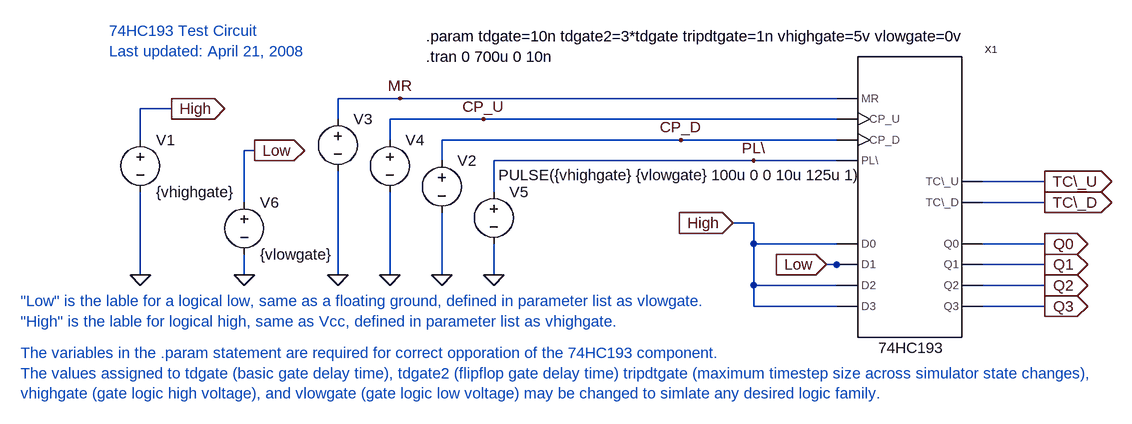
[diagram p0: schematic 74HC193_test.asc]
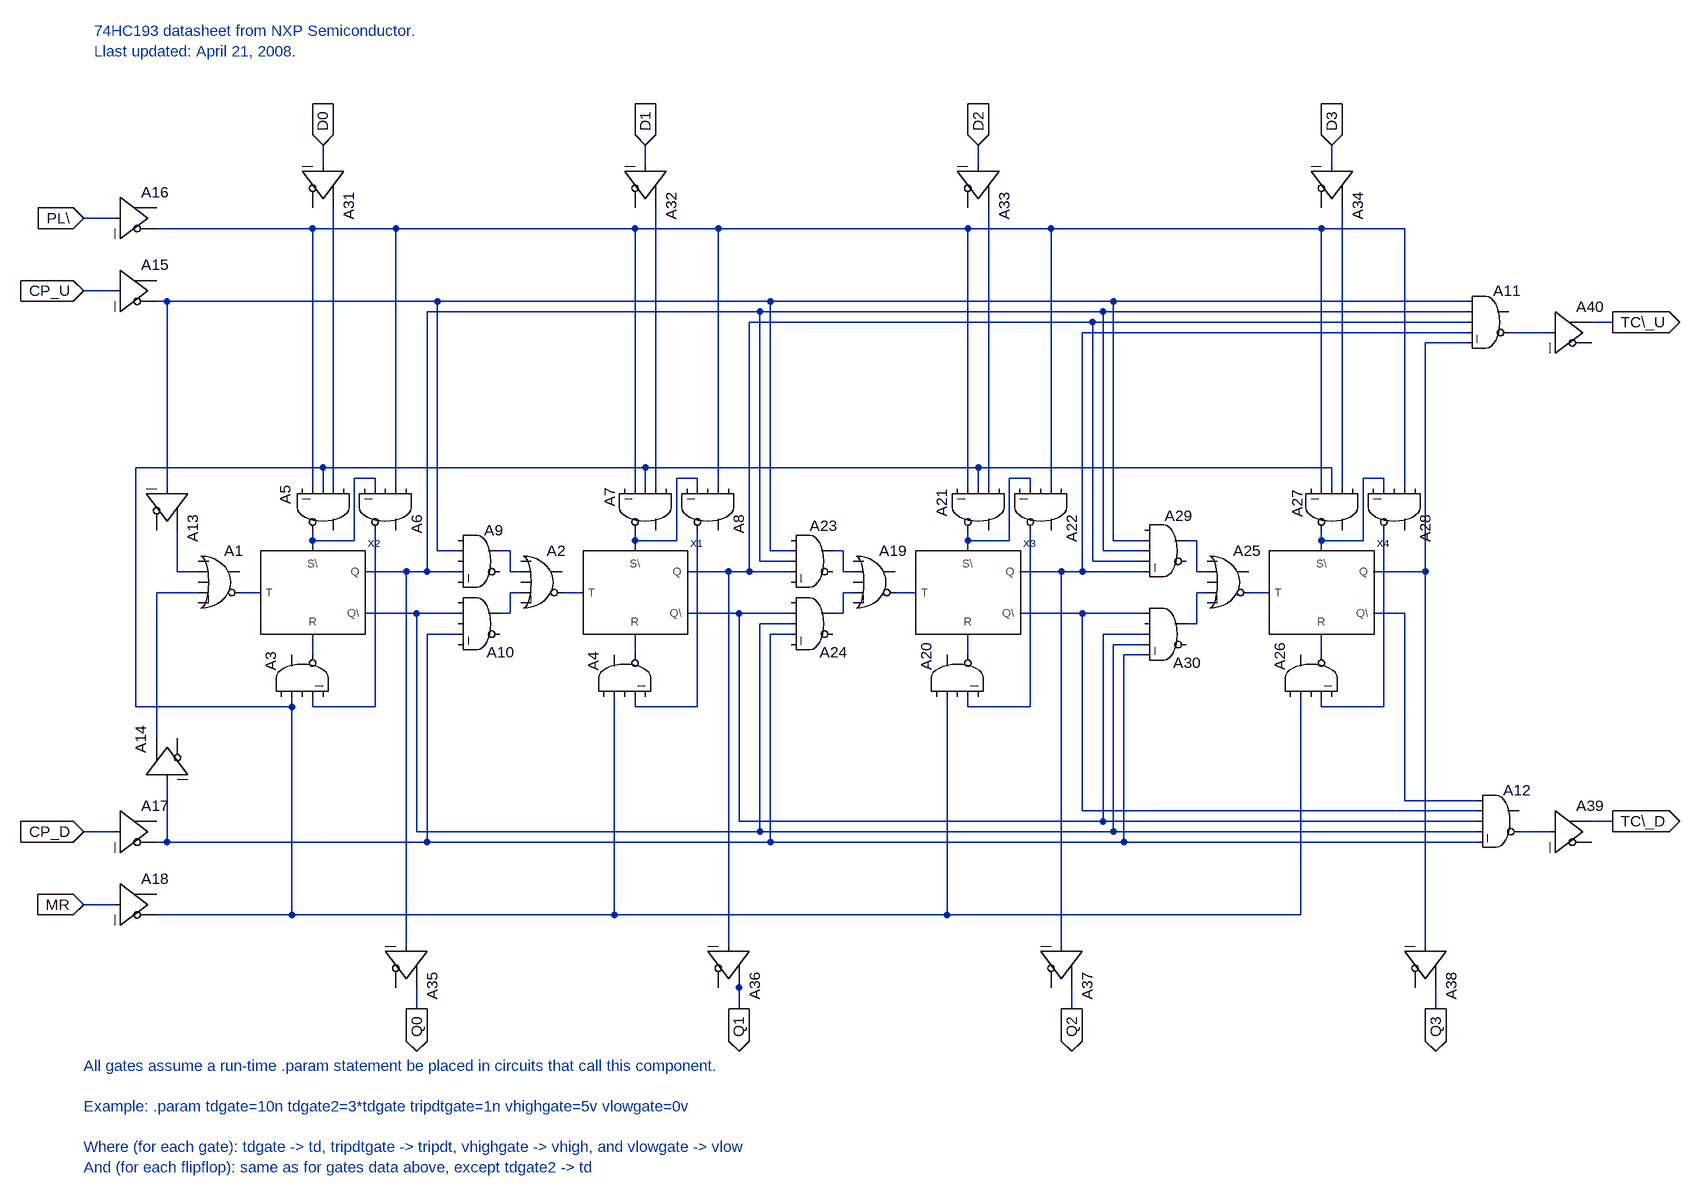
[diagram p1: sub-circuit 74hc193.asc]
74HC193_test.asc, the LTspice schematic file:
Version 4
SHEET 1 1604 868
WIRE -992 -96 -1088 -96
WIRE -320 -96 -992 -96
WIRE -1344 -80 -1392 -80
WIRE -1088 -64 -1088 -96
WIRE -864 -64 -1008 -64
WIRE -320 -64 -864 -64
WIRE -1392 -32 -1392 -80
WIRE -1008 -32 -1008 -64
WIRE -560 -32 -928 -32
WIRE -320 -32 -560 -32
WIRE -1216 -16 -1232 -16
WIRE -928 0 -928 -32
WIRE -448 0 -848 0
WIRE -320 0 -448 0
WIRE 0 32 -96 32
WIRE -848 48 -848 0
WIRE -1232 64 -1232 -16
WIRE 0 64 -96 64
WIRE -448 96 -480 96
WIRE -448 128 -448 96
WIRE -320 128 -448 128
WIRE 0 128 -96 128
WIRE -320 160 -336 160
WIRE -304 160 -320 160
WIRE 0 160 -96 160
WIRE -1392 176 -1392 48
WIRE -1232 176 -1232 144
WIRE -1088 176 -1088 16
WIRE -1008 176 -1008 48
WIRE -928 176 -928 80
WIRE -848 176 -848 128
WIRE -448 192 -448 128
WIRE -320 192 -448 192
WIRE 0 192 -96 192
WIRE -448 224 -448 192
WIRE -320 224 -448 224
WIRE 0 224 -96 224
FLAG -1392 176 0
FLAG -1344 -80 High
IOPIN -1344 -80 Out
FLAG -480 96 High
IOPIN -480 96 In
FLAG -928 176 0
FLAG 0 128 Q0
IOPIN 0 128 Out
FLAG 0 160 Q1
IOPIN 0 160 Out
FLAG 0 192 Q2
IOPIN 0 192 Out
FLAG 0 224 Q3
IOPIN 0 224 Out
FLAG -1088 176 0
FLAG 0 32 TC\_U
IOPIN 0 32 Out
FLAG 0 64 TC\_D
IOPIN 0 64 Out
FLAG -1008 176 0
FLAG -848 176 0
FLAG -992 -96 MR
FLAG -864 -64 CP_U
FLAG -560 -32 CP_D
FLAG -448 0 PL\
FLAG -1232 176 0
FLAG -1216 -16 Low
IOPIN -1216 -16 Out
FLAG -336 160 Low
IOPIN -336 160 In
SYMBOL 74HC193 -208 -192 R0
SYMATTR InstName X1
SYMBOL voltage -1392 -48 R0
WINDOW 123 0 0 Left 0
WINDOW 39 0 0 Left 0
SYMATTR InstName V1
SYMATTR Value {vhighgate}
SYMBOL voltage -1088 -80 R0
WINDOW 123 0 0 Left 0
WINDOW 39 0 0 Left 0
WINDOW 3 7 -13 Invisible 0
SYMATTR Value PWL(0 {vlowgate} 27u {vlowgate} 28u {vhighgate} 37u {vhighgate} 38u {vlowgate} 637u {vlowgate} 638u {vhighgate} 647u {vhighgate} 648u {vlowgate})
SYMATTR InstName V3
SYMBOL voltage -1008 -48 R0
WINDOW 123 0 0 Left 0
WINDOW 39 0 0 Left 0
WINDOW 3 24 104 Invisible 0
SYMATTR Value PWL(0 {vhighgate} 164u {vhighgate} 165u {vlowgate} 184u {vlowgate} 185u {vhighgate} 204u {vhighgate} 205u {vlowgate} 224u {vlowgate} 225u {vhighgate} 244u {vhighgate} 245u {vlowgate} 264u {vlowgate} 265u {vhighgate} 284u {vhighgate} 285u {vlowgate} 304u {vlowgate} 305u {vhighgate} 324u {vhighgate} 325u {vlowgate} 344u {vlowgate} 345u {vhighgate})
SYMATTR InstName V4
SYMBOL voltage -848 32 R0
WINDOW 3 7 -10 Left 0
WINDOW 123 0 0 Left 0
WINDOW 39 0 0 Left 0
SYMATTR Value PULSE({vhighgate} {vlowgate} 100u 0 0 10u 125u 1)
SYMATTR InstName V5
SYMBOL voltage -928 -16 R0
WINDOW 123 0 0 Left 0
WINDOW 39 0 0 Left 0
WINDOW 3 24 104 Invisible 0
SYMATTR Value PWL(0 {vhighgate} 434u {vhighgate} 435u {vlowgate} 454u {vlowgate} 455u {vhighgate} 474u {vhighgate} 475u {vlowgate} 494u {vlowgate} 495u {vhighgate} 514u {vhighgate} 515u {vlowgate} 534u {vlowgate} 535u {vhighgate} 554u {vhighgate} 555u {vlowgate} 574u {vlowgate} 575u {vhighgate} 594u {vhighgate} 595u {vlowgate} 614u {vlowgate} 615u {vhighgate})
SYMATTR InstName V2
SYMBOL voltage -1232 48 R0
WINDOW 123 0 0 Left 0
WINDOW 39 0 0 Left 0
SYMATTR InstName V6
SYMATTR Value {vlowgate}
TEXT -952 -160 Left 0 !.tran 0 700u 0 10n
TEXT -1576 216 Left 0 ;"Low" is the lable for a logical low, same as a floating ground, defined in parameter list as vlowgate.\n"High" is the lable for logical high, same as Vcc, defined in parameter list as vhighgate.
TEXT -952 -192 Left 0 !.param tdgate=10n tdgate2=3*tdgate tripdtgate=1n vhighgate=5v vlowgate=0v
TEXT -1576 296 Left 0 ;The variables in the .param statement are required for correct opporation of the 74HC193 component.\nThe values assigned to tdgate (basic gate delay time), tdgate2 (flipflop gate delay time) tripdtgate (maximum timestep size across simulator state changes),\nvhighgate (gate logic high voltage), and vlowgate (gate logic low voltage) may be changed to simlate any desired logic family.
TEXT -1440 -200 Left 0 ;74HC193 Test Circuit\nLast updated: April 21, 2008

74hc193.asc, the sub-circuit schematic file:
Version 4
SHEET 1 1604 1044
WIRE -528 -544 -528 -576
WIRE -32 -544 -32 -576
WIRE 480 -544 480 -576
WIRE 1024 -544 1024 -576
WIRE -848 -464 -896 -464
WIRE -544 -448 -784 -448
WIRE -416 -448 -544 -448
WIRE -48 -448 -416 -448
WIRE 80 -448 -48 -448
WIRE 464 -448 80 -448
WIRE 592 -448 464 -448
WIRE 1008 -448 592 -448
WIRE 1136 -448 1008 -448
WIRE -848 -352 -896 -352
WIRE -768 -336 -784 -336
WIRE -352 -336 -768 -336
WIRE 160 -336 -352 -336
WIRE 688 -336 160 -336
WIRE 1232 -336 688 -336
WIRE 144 -320 -368 -320
WIRE 672 -320 144 -320
WIRE 1232 -320 672 -320
WIRE 656 -304 128 -304
WIRE 1232 -304 656 -304
WIRE 1456 -304 1424 -304
WIRE 1232 -288 640 -288
WIRE 1360 -288 1296 -288
WIRE 1232 -272 1168 -272
WIRE -528 -80 -816 -80
WIRE -32 -80 -528 -80
WIRE 480 -80 -32 -80
WIRE 1024 -80 480 -80
WIRE -448 -64 -480 -64
WIRE 48 -64 16 -64
WIRE 560 -64 528 -64
WIRE 1104 -64 1072 -64
WIRE -768 -48 -768 -336
WIRE -544 -48 -544 -448
WIRE -528 -48 -528 -80
WIRE -512 -48 -512 -480
WIRE -448 -48 -448 -64
WIRE -416 -48 -416 -448
WIRE -48 -48 -48 -448
WIRE -32 -48 -32 -80
WIRE -16 -48 -16 -480
WIRE 48 -48 48 -64
WIRE 80 -48 80 -448
WIRE 464 -48 464 -448
WIRE 480 -48 480 -80
WIRE 496 -48 496 -480
WIRE 560 -48 560 -64
WIRE 592 -48 592 -448
WIRE 1008 -48 1008 -448
WIRE 1024 -48 1024 -80
WIRE 1040 -48 1040 -480
WIRE 1104 -48 1104 -64
WIRE 1136 -48 1136 -448
WIRE -544 32 -544 16
WIRE -480 32 -480 -64
WIRE -480 32 -544 32
WIRE -48 32 -48 16
WIRE 16 32 16 -64
WIRE 16 32 -48 32
WIRE 464 32 464 16
WIRE 528 32 528 -64
WIRE 528 32 464 32
WIRE 688 32 688 -336
WIRE 736 32 688 32
WIRE 816 32 800 32
WIRE 1008 32 1008 16
WIRE 1072 32 1072 -64
WIRE 1072 32 1008 32
WIRE -544 48 -544 32
WIRE -352 48 -352 -336
WIRE -320 48 -352 48
WIRE -240 48 -256 48
WIRE -48 48 -48 32
WIRE 160 48 160 -336
WIRE 192 48 160 48
WIRE 272 48 256 48
WIRE 464 48 464 32
WIRE 672 48 672 -320
WIRE 736 48 672 48
WIRE 1008 48 1008 32
WIRE 144 64 144 -320
WIRE 192 64 144 64
WIRE 656 64 656 -304
WIRE 736 64 656 64
WIRE -752 80 -752 16
WIRE -720 80 -752 80
WIRE -400 80 -464 80
WIRE -368 80 -368 -320
WIRE -368 80 -400 80
WIRE -320 80 -368 80
WIRE -240 80 -240 48
WIRE -224 80 -240 80
WIRE 96 80 32 80
WIRE 128 80 128 -304
WIRE 128 80 96 80
WIRE 192 80 128 80
WIRE 272 80 272 48
WIRE 288 80 272 80
WIRE 608 80 544 80
WIRE 640 80 640 -288
WIRE 640 80 608 80
WIRE 736 80 640 80
WIRE 816 80 816 32
WIRE 832 80 816 80
WIRE 1168 80 1168 -272
WIRE 1168 80 1088 80
WIRE -720 112 -784 112
WIRE -624 112 -656 112
WIRE -224 112 -240 112
WIRE -128 112 -160 112
WIRE 288 112 272 112
WIRE 384 112 352 112
WIRE 832 112 816 112
WIRE 928 112 896 112
WIRE -384 144 -464 144
WIRE -320 144 -384 144
WIRE -240 144 -240 112
WIRE -240 144 -256 144
WIRE 112 144 32 144
WIRE 192 144 112 144
WIRE 272 144 272 112
WIRE 272 144 256 144
WIRE 640 144 544 144
WIRE 736 144 640 144
WIRE 1136 144 1088 144
WIRE 192 160 144 160
WIRE 816 160 816 112
WIRE 816 160 800 160
WIRE -320 176 -368 176
WIRE 192 176 160 176
WIRE 736 176 672 176
WIRE 736 192 688 192
WIRE -544 208 -544 176
WIRE -48 208 -48 176
WIRE 464 208 464 176
WIRE 736 208 704 208
WIRE 1008 208 1008 176
WIRE -816 288 -816 -80
WIRE -576 288 -576 272
WIRE -576 288 -816 288
WIRE -544 288 -544 272
WIRE -448 288 -448 16
WIRE -448 288 -544 288
WIRE -48 288 -48 272
WIRE 48 288 48 16
WIRE 48 288 -48 288
WIRE 464 288 464 272
WIRE 560 288 560 16
WIRE 560 288 464 288
WIRE 1008 288 1008 272
WIRE 1104 288 1104 16
WIRE 1104 288 1008 288
WIRE -784 336 -784 112
WIRE 1136 432 1136 144
WIRE 1248 432 1136 432
WIRE 640 448 640 144
WIRE 1248 448 640 448
WIRE 112 464 112 144
WIRE 672 464 672 176
WIRE 672 464 112 464
WIRE 1248 464 672 464
WIRE 1456 464 1424 464
WIRE -848 480 -896 480
WIRE -384 480 -384 144
WIRE 144 480 144 160
WIRE 144 480 -384 480
WIRE 688 480 688 192
WIRE 688 480 144 480
WIRE 1248 480 688 480
WIRE 1360 480 1312 480
WIRE -768 496 -768 400
WIRE -768 496 -784 496
WIRE -368 496 -368 176
WIRE -368 496 -768 496
WIRE 160 496 160 176
WIRE 160 496 -368 496
WIRE 704 496 704 208
WIRE 704 496 160 496
WIRE 1248 496 704 496
WIRE -848 592 -896 592
WIRE -576 608 -576 288
WIRE -576 608 -784 608
WIRE -80 608 -80 272
WIRE -80 608 -576 608
WIRE 432 608 432 272
WIRE 432 608 -80 608
WIRE 976 608 976 272
WIRE 976 608 432 608
WIRE -400 656 -400 80
WIRE 96 656 96 80
WIRE 608 656 608 80
WIRE 1168 656 1168 80
WIRE 112 720 112 704
WIRE -384 752 -384 720
WIRE 112 752 112 720
WIRE 624 752 624 720
WIRE 1184 752 1184 720
FLAG -896 -464 PL\
IOPIN -896 -464 In
FLAG -896 -352 CP_U
IOPIN -896 -352 In
FLAG -896 480 CP_D
IOPIN -896 480 In
FLAG -896 592 MR
IOPIN -896 592 In
FLAG -528 -576 D0
IOPIN -528 -576 In
FLAG -32 -576 D1
IOPIN -32 -576 In
FLAG 480 -576 D2
IOPIN 480 -576 In
FLAG 1024 -576 D3
IOPIN 1024 -576 In
FLAG 1456 -304 TC\_U
IOPIN 1456 -304 Out
FLAG 1456 464 TC\_D
IOPIN 1456 464 Out
FLAG 1184 752 Q3
IOPIN 1184 752 Out
FLAG 624 752 Q2
IOPIN 624 752 Out
FLAG 112 752 Q1
IOPIN 112 752 Out
FLAG -384 752 Q0
IOPIN -384 752 Out
SYMBOL TnotSRFlipFlopfromD -48 112 R0
SYMATTR InstName X1
SYMBOL TnotSRFlipFlopfromD -544 112 R0
SYMATTR InstName X2
SYMBOL Digital\\or -688 32 R0
SYMATTR InstName A1
SYMATTR Value2 td={tdgate} tripdt={tripdtgate} vhigh={vhighgate} vlow={vlowgate}
SYMBOL Digital\\or -192 32 R0
SYMATTR InstName A2
SYMATTR Value2 td={tdgate} tripdt={tripdtgate} vhigh={vhighgate} vlow={vlowgate}
SYMBOL Digital\\and -464 -16 R90
WINDOW 0 -37 122 Left 0
SYMATTR InstName A5
SYMATTR Value2 td={tdgate} tripdt={tripdtgate} vhigh={vhighgate} vlow={vlowgate}
SYMBOL Digital\\and -368 -16 R90
SYMATTR InstName A6
SYMATTR Value2 td={tdgate} tripdt={tripdtgate} vhigh={vhighgate} vlow={vlowgate}
SYMBOL Digital\\and 32 -16 R90
WINDOW 0 -33 119 Left 0
SYMATTR InstName A7
SYMATTR Value2 td={tdgate} tripdt={tripdtgate} vhigh={vhighgate} vlow={vlowgate}
SYMBOL Digital\\and 128 -16 R90
SYMATTR InstName A8
SYMATTR Value2 td={tdgate} tripdt={tripdtgate} vhigh={vhighgate} vlow={vlowgate}
SYMBOL Digital\\and -288 0 R0
SYMATTR InstName A9
SYMATTR Value2 td={tdgate} tripdt={tripdtgate} vhigh={vhighgate} vlow={vlowgate}
SYMBOL Digital\\and -288 96 R0
WINDOW 0 12 108 Left 0
SYMATTR InstName A10
SYMATTR Value2 td={tdgate} tripdt={tripdtgate} vhigh={vhighgate} vlow={vlowgate}
SYMBOL Digital\\and 1264 -368 R0
SYMATTR InstName A11
SYMATTR Value2 td={tdgate} tripdt={tripdtgate} vhigh={vhighgate} vlow={vlowgate}
SYMBOL Digital\\and 1280 400 R0
SYMATTR InstName A12
SYMATTR Value2 td={tdgate} tripdt={tripdtgate} vhigh={vhighgate} vlow={vlowgate}
SYMBOL Digital\\buf -704 -48 R90
SYMATTR InstName A13
SYMATTR Value2 td={tdgate} tripdt={tripdtgate} vhigh={vhighgate} vlow={vlowgate}
SYMBOL Digital\\buf -832 400 R270
SYMATTR InstName A14
SYMATTR Value2 td={tdgate} tripdt={tripdtgate} vhigh={vhighgate} vlow={vlowgate}
SYMBOL Digital\\buf -848 -416 R0
SYMATTR InstName A15
SYMATTR Value2 td={tdgate} tripdt={tripdtgate} vhigh={vhighgate} vlow={vlowgate}
SYMBOL Digital\\buf -848 -528 R0
SYMATTR InstName A16
SYMATTR Value2 td={tdgate} tripdt={tripdtgate} vhigh={vhighgate} vlow={vlowgate}
SYMBOL Digital\\buf -848 416 R0
SYMATTR InstName A17
SYMATTR Value2 td={tdgate} tripdt={tripdtgate} vhigh={vhighgate} vlow={vlowgate}
SYMBOL Digital\\buf -848 528 R0
SYMATTR InstName A18
SYMATTR Value2 td={tdgate} tripdt={tripdtgate} vhigh={vhighgate} vlow={vlowgate}
SYMBOL TnotSRFlipFlopfromD 464 112 R0
SYMATTR InstName X3
SYMBOL Digital\\or 320 32 R0
SYMATTR InstName A19
SYMATTR Value2 td={tdgate} tripdt={tripdtgate} vhigh={vhighgate} vlow={vlowgate}
SYMBOL Digital\\and 544 -16 R90
WINDOW 0 -31 120 Left 0
SYMATTR InstName A21
SYMATTR Value2 td={tdgate} tripdt={tripdtgate} vhigh={vhighgate} vlow={vlowgate}
SYMBOL Digital\\and 640 -16 R90
SYMATTR InstName A22
SYMATTR Value2 td={tdgate} tripdt={tripdtgate} vhigh={vhighgate} vlow={vlowgate}
SYMBOL Digital\\and 224 0 R0
WINDOW 0 -3 9 Left 0
SYMATTR InstName A23
SYMATTR Value2 td={tdgate} tripdt={tripdtgate} vhigh={vhighgate} vlow={vlowgate}
SYMBOL Digital\\and 224 96 R0
WINDOW 0 12 108 Left 0
SYMATTR InstName A24
SYMATTR Value2 td={tdgate} tripdt={tripdtgate} vhigh={vhighgate} vlow={vlowgate}
SYMBOL TnotSRFlipFlopfromD 1008 112 R0
SYMATTR InstName X4
SYMBOL Digital\\or 864 32 R0
SYMATTR InstName A25
SYMATTR Value2 td={tdgate} tripdt={tripdtgate} vhigh={vhighgate} vlow={vlowgate}
SYMBOL Digital\\and 1088 -16 R90
WINDOW 0 -30 117 Left 0
SYMATTR InstName A27
SYMATTR Value2 td={tdgate} tripdt={tripdtgate} vhigh={vhighgate} vlow={vlowgate}
SYMBOL Digital\\and 1184 -16 R90
SYMATTR InstName A28
SYMATTR Value2 td={tdgate} tripdt={tripdtgate} vhigh={vhighgate} vlow={vlowgate}
SYMBOL Digital\\and 768 -16 R0
WINDOW 0 -1 10 Left 0
SYMATTR InstName A29
SYMATTR Value2 td={tdgate} tripdt={tripdtgate} vhigh={vhighgate} vlow={vlowgate}
SYMBOL Digital\\and 768 112 R0
WINDOW 0 12 108 Left 0
SYMATTR InstName A30
SYMATTR Value2 td={tdgate} tripdt={tripdtgate} vhigh={vhighgate} vlow={vlowgate}
SYMBOL Digital\\buf -464 -544 R90
SYMATTR InstName A31
SYMATTR Value2 td={tdgate} tripdt={tripdtgate} vhigh={vhighgate} vlow={vlowgate}
SYMBOL Digital\\buf 32 -544 R90
SYMATTR InstName A32
SYMATTR Value2 td={tdgate} tripdt={tripdtgate} vhigh={vhighgate} vlow={vlowgate}
SYMBOL Digital\\buf 544 -544 R90
SYMATTR InstName A33
SYMATTR Value2 td={tdgate} tripdt={tripdtgate} vhigh={vhighgate} vlow={vlowgate}
SYMBOL Digital\\buf 1088 -544 R90
SYMATTR InstName A34
SYMATTR Value2 td={tdgate} tripdt={tripdtgate} vhigh={vhighgate} vlow={vlowgate}
SYMBOL Digital\\buf -336 656 R90
SYMATTR InstName A35
SYMATTR Value2 td={tdgate} tripdt={tripdtgate} vhigh={vhighgate} vlow={vlowgate}
SYMBOL Digital\\buf 160 656 R90
SYMATTR InstName A36
SYMATTR Value2 td={tdgate} tripdt={tripdtgate} vhigh={vhighgate} vlow={vlowgate}
SYMBOL Digital\\buf 672 656 R90
SYMATTR InstName A37
SYMATTR Value2 td={tdgate} tripdt={tripdtgate} vhigh={vhighgate} vlow={vlowgate}
SYMBOL Digital\\buf 1232 656 R90
SYMATTR InstName A38
SYMATTR Value2 td={tdgate} tripdt={tripdtgate} vhigh={vhighgate} vlow={vlowgate}
SYMBOL Digital\\buf 1360 416 R0
SYMATTR InstName A39
SYMATTR Value2 td={tdgate} tripdt={tripdtgate} vhigh={vhighgate} vlow={vlowgate}
SYMBOL Digital\\buf 1360 -352 R0
SYMATTR InstName A40
SYMATTR Value2 td={tdgate} tripdt={tripdtgate} vhigh={vhighgate} vlow={vlowgate}
SYMBOL Digital\\and -624 240 R270
SYMATTR InstName A3
SYMATTR Value2 td={tdgate} tripdt={tripdtgate} vhigh={vhighgate} vlow={vlowgate}
SYMBOL Digital\\and -128 240 R270
SYMATTR InstName A4
SYMATTR Value2 td={tdgate} tripdt={tripdtgate} vhigh={vhighgate} vlow={vlowgate}
SYMBOL Digital\\and 384 240 R270
SYMATTR InstName A20
SYMATTR Value2 td={tdgate} tripdt={tripdtgate} vhigh={vhighgate} vlow={vlowgate}
SYMBOL Digital\\and 928 240 R270
SYMATTR InstName A26
SYMATTR Value2 td={tdgate} tripdt={tripdtgate} vhigh={vhighgate} vlow={vlowgate}
TEXT -880 -752 Left 0 ;74HC193 datasheet from NXP Semiconductor. \nLlast updated: April 21, 2008.
TEXT -896 840 Left 0 ;All gates assume a run-time .param statement be placed in circuits that call this component.\n \nExample: .param tdgate=10n tdgate2=3*tdgate tripdtgate=1n vhighgate=5v vlowgate=0v\n \nWhere (for each gate): tdgate -> td, tripdtgate -> tripdt, vhighgate -> vhigh, and vlowgate -> vlow\nAnd (for each flipflop): same as for gates data above, except tdgate2 -> td

The netlist it stands for:
* 74HC193_test.asc
XX1 MR CP_U PL\ CP_D High Low High High Q0 Q1 Q2 Q3 TC\_D TC\_U 74hc193 params: 74HC193
V1 High 0 {vhighgate}
V3 MR 0 PWL(0 {vlowgate} 27u {vlowgate} 28u {vhighgate} 37u {vhighgate} 38u {vlowgate} 637u {vlowgate} 638u {vhighgate} 647u {vhighgate} 648u {vlowgate})
V4 CP_U 0 PWL(0 {vhighgate} 164u {vhighgate} 165u {vlowgate} 184u {vlowgate} 185u {vhighgate} 204u {vhighgate} 205u {vlowgate} 224u {vlowgate} 225u {vhighgate} 244u {vhighgate} 245u {vlowgate} 264u {vlowgate} 265u {vhighgate} 284u {vhighgate} 285u {vlowgate} 304u {vlowgate} 305u {vhighgate} 324u {vhighgate} 325u {vlowgate} 344u {vlowgate} 345u {vhighgate})
V5 PL\ 0 PULSE({vhighgate} {vlowgate} 100u 0 0 10u 125u 1)
V2 CP_D 0 PWL(0 {vhighgate} 434u {vhighgate} 435u {vlowgate} 454u {vlowgate} 455u {vhighgate} 474u {vhighgate} 475u {vlowgate} 494u {vlowgate} 495u {vhighgate} 514u {vhighgate} 515u {vlowgate} 534u {vlowgate} 535u {vhighgate} 554u {vhighgate} 555u {vlowgate} 574u {vlowgate} 575u {vhighgate} 594u {vhighgate} 595u {vlowgate} 614u {vlowgate} 615u {vhighgate})
V6 Low 0 {vlowgate}

* block symbol definitions
.subckt 74hc193 MR CP_U PL\ CP_D D0 D1 D2 D3 Q0 Q1 Q2 Q3 TC\_D TC\_U
XX1 N004 N030 N010 N035 N024 TnotSRFlipFlopfromD  ; pins Q Q\ S\ R T
XX2 N003 N029 N009 N034 N022 TnotSRFlipFlopfromD  ; pins Q Q\ S\ R T
A1 0 N020 0 N021 0 N022 0 0 OR td={tdgate} tripdt={tripdtgate} vhigh={vhighgate} vlow={vlowgate}
A2 0 N018 0 N023 0 N024 0 0 OR td={tdgate} tripdt={tripdtgate} vhigh={vhighgate} vlow={vlowgate}
A5 0 N013 N008 N001 0 N009 0 0 AND td={tdgate} tripdt={tripdtgate} vhigh={vhighgate} vlow={vlowgate}
A6 0 N001 0 N009 0 N038 0 0 AND td={tdgate} tripdt={tripdtgate} vhigh={vhighgate} vlow={vlowgate}
A7 0 N014 N008 N001 0 N010 0 0 AND td={tdgate} tripdt={tripdtgate} vhigh={vhighgate} vlow={vlowgate}
A8 0 N001 0 N010 0 N039 0 0 AND td={tdgate} tripdt={tripdtgate} vhigh={vhighgate} vlow={vlowgate}
A9 0 N002 0 N003 0 0 N018 0 AND td={tdgate} tripdt={tripdtgate} vhigh={vhighgate} vlow={vlowgate}
A10 0 N029 0 N033 0 0 N023 0 AND td={tdgate} tripdt={tripdtgate} vhigh={vhighgate} vlow={vlowgate}
A11 N002 N003 N004 N005 N007 N006 0 0 AND td={tdgate} tripdt={tripdtgate} vhigh={vhighgate} vlow={vlowgate}
A12 N032 N031 N030 N029 N033 N042 0 0 AND td={tdgate} tripdt={tripdtgate} vhigh={vhighgate} vlow={vlowgate}
A13 N002 0 0 0 0 0 N020 0 BUF td={tdgate} tripdt={tripdtgate} vhigh={vhighgate} vlow={vlowgate}
A14 N033 0 0 0 0 0 N021 0 BUF td={tdgate} tripdt={tripdtgate} vhigh={vhighgate} vlow={vlowgate}
A15 CP_U 0 0 0 0 N002 0 0 BUF td={tdgate} tripdt={tripdtgate} vhigh={vhighgate} vlow={vlowgate}
A16 PL\ 0 0 0 0 N001 0 0 BUF td={tdgate} tripdt={tripdtgate} vhigh={vhighgate} vlow={vlowgate}
A17 CP_D 0 0 0 0 N033 0 0 BUF td={tdgate} tripdt={tripdtgate} vhigh={vhighgate} vlow={vlowgate}
A18 MR 0 0 0 0 N008 0 0 BUF td={tdgate} tripdt={tripdtgate} vhigh={vhighgate} vlow={vlowgate}
XX3 N005 N031 N011 N036 N026 TnotSRFlipFlopfromD  ; pins Q Q\ S\ R T
A19 0 N019 0 N025 0 N026 0 0 OR td={tdgate} tripdt={tripdtgate} vhigh={vhighgate} vlow={vlowgate}
A21 0 N015 N008 N001 0 N011 0 0 AND td={tdgate} tripdt={tripdtgate} vhigh={vhighgate} vlow={vlowgate}
A22 0 N001 0 N011 0 N040 0 0 AND td={tdgate} tripdt={tripdtgate} vhigh={vhighgate} vlow={vlowgate}
A23 0 N002 N003 N004 0 0 N019 0 AND td={tdgate} tripdt={tripdtgate} vhigh={vhighgate} vlow={vlowgate}
A24 0 N030 N029 N033 0 0 N025 0 AND td={tdgate} tripdt={tripdtgate} vhigh={vhighgate} vlow={vlowgate}
XX4 N007 N032 N012 N037 N028 TnotSRFlipFlopfromD  ; pins Q Q\ S\ R T
A25 0 N017 0 N027 0 N028 0 0 OR td={tdgate} tripdt={tripdtgate} vhigh={vhighgate} vlow={vlowgate}
A27 0 N016 N008 N001 0 N012 0 0 AND td={tdgate} tripdt={tripdtgate} vhigh={vhighgate} vlow={vlowgate}
A28 0 N001 0 N012 0 N041 0 0 AND td={tdgate} tripdt={tripdtgate} vhigh={vhighgate} vlow={vlowgate}
A29 0 N002 N003 N004 N005 0 N017 0 AND td={tdgate} tripdt={tripdtgate} vhigh={vhighgate} vlow={vlowgate}
A30 N031 0 N030 N029 N033 0 N027 0 AND td={tdgate} tripdt={tripdtgate} vhigh={vhighgate} vlow={vlowgate}
A31 D0 0 0 0 0 0 N013 0 BUF td={tdgate} tripdt={tripdtgate} vhigh={vhighgate} vlow={vlowgate}
A32 D1 0 0 0 0 0 N014 0 BUF td={tdgate} tripdt={tripdtgate} vhigh={vhighgate} vlow={vlowgate}
A33 D2 0 0 0 0 0 N015 0 BUF td={tdgate} tripdt={tripdtgate} vhigh={vhighgate} vlow={vlowgate}
A34 D3 0 0 0 0 0 N016 0 BUF td={tdgate} tripdt={tripdtgate} vhigh={vhighgate} vlow={vlowgate}
A35 N003 0 0 0 0 0 Q0 0 BUF td={tdgate} tripdt={tripdtgate} vhigh={vhighgate} vlow={vlowgate}
A36 N004 0 0 0 0 0 Q1 0 BUF td={tdgate} tripdt={tripdtgate} vhigh={vhighgate} vlow={vlowgate}
A37 N005 0 0 0 0 0 Q2 0 BUF td={tdgate} tripdt={tripdtgate} vhigh={vhighgate} vlow={vlowgate}
A38 N007 0 0 0 0 0 Q3 0 BUF td={tdgate} tripdt={tripdtgate} vhigh={vhighgate} vlow={vlowgate}
A39 N042 0 0 0 0 0 TC\_D 0 BUF td={tdgate} tripdt={tripdtgate} vhigh={vhighgate} vlow={vlowgate}
A40 N006 0 0 0 0 0 TC\_U 0 BUF td={tdgate} tripdt={tripdtgate} vhigh={vhighgate} vlow={vlowgate}
A3 0 N008 0 N038 0 N034 0 0 AND td={tdgate} tripdt={tripdtgate} vhigh={vhighgate} vlow={vlowgate}
A4 0 N008 0 N039 0 N035 0 0 AND td={tdgate} tripdt={tripdtgate} vhigh={vhighgate} vlow={vlowgate}
A20 0 N008 0 N040 0 N036 0 0 AND td={tdgate} tripdt={tripdtgate} vhigh={vhighgate} vlow={vlowgate}
A26 0 N008 0 N041 0 N037 0 0 AND td={tdgate} tripdt={tripdtgate} vhigh={vhighgate} vlow={vlowgate}
* 74HC193 datasheet from NXP Semiconductor.
* Llast updated: April 21, 2008.
* All gates assume a run-time .param statement be placed in circuits that call this component.
* Example: .param tdgate=10n tdgate2=3*tdgate tripdtgate=1n vhighgate=5v vlowgate=0v
* Where (for each gate): tdgate -> td, tripdtgate -> tripdt, vhighgate -> vhigh, and vlowgate -> vlow
* And (for each flipflop): same as for gates data above, except tdgate2 -> td
.ends 74hc193

.tran 0 700u 0 10n
* "Low" is the lable for a logical low, same as a floating ground, defined in parameter list as vlowgate.
* "High" is the lable for logical high, same as Vcc, defined in parameter list as vhighgate.
.param tdgate=10n tdgate2=3*tdgate tripdtgate=1n vhighgate=5v vlowgate=0v
* The variables in the .param statement are required for correct opporation of the 74HC193 component.
* The values assigned to tdgate (basic gate delay time), tdgate2 (flipflop gate delay time) tripdtgate (maximum timestep size across simulator state changes),
* vhighgate (gate logic high voltage), and vlowgate (gate logic low voltage) may be changed to simlate any desired logic family.
* 74HC193 Test Circuit
* Last updated: April 21, 2008
.backanno
.end